# Altium schematic sheet Microcontroller.SchDoc: Microcontroller
size 228 x 165 mm; DrawnBy: Joseph Riesen; DocumentNumber: 2; Revision: 1.0; SheetNumber: 2; SheetTotal: 10
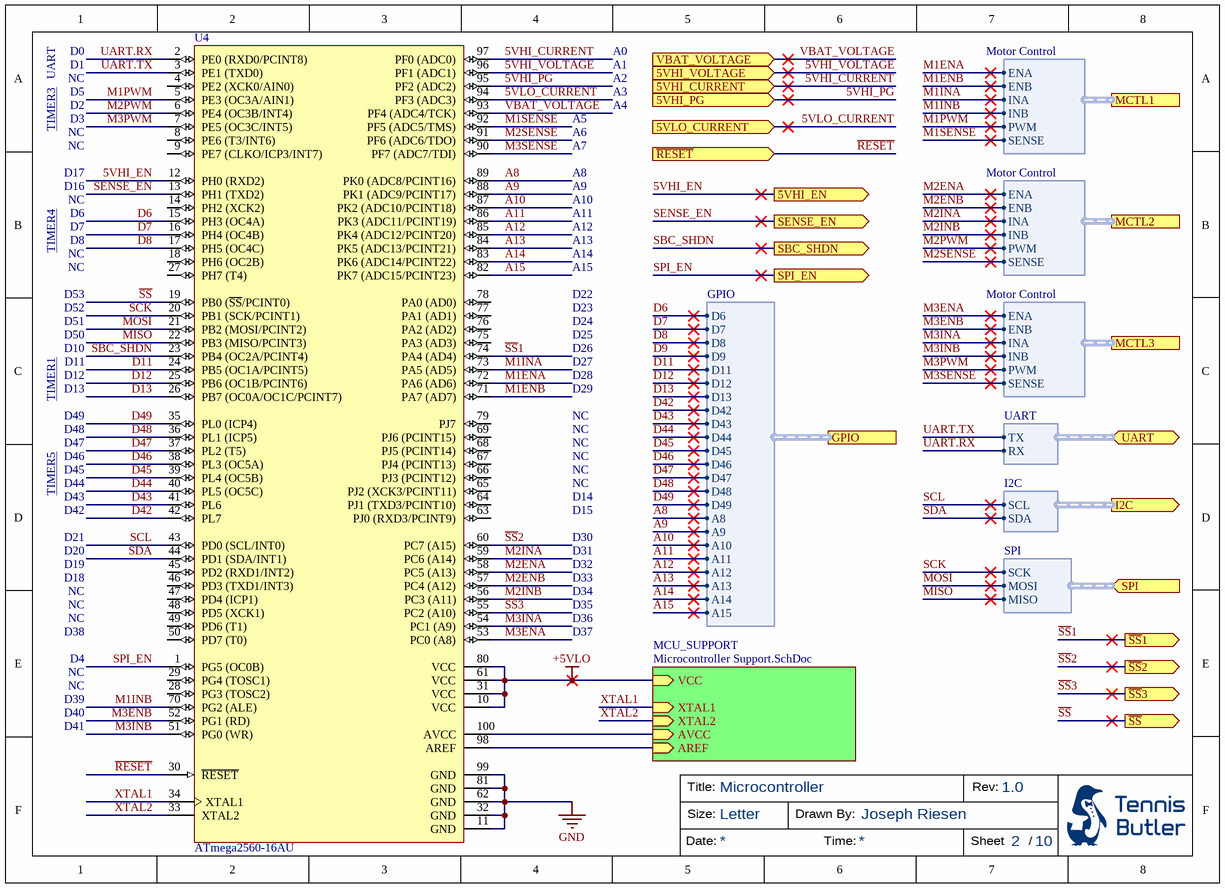
[diagram p0: Microcontroller.SchDoc]

## Parts
U4  ATmega2560-16AU  [TSQFP50P1600X1600X120-100M]

## Sub-sheets
MCU_SUPPORT = Microcontroller Support.SchDoc: XTAL2 (in), XTAL1 (in), AVCC (in), AREF (in), VCC (in)  | ComponentClassName: MCU

## Ports
5VHI_CURRENT (in), 5VHI_EN (out), 5VHI_PG (in), 5VHI_VOLTAGE (in), 5VLO_CURRENT (in), GPIO (harness GPIO), I2C (out, harness I2C), MCTL1 (harness Motor Control), MCTL2 (harness Motor Control), MCTL3 (harness Motor Control), SBC_SHDN (out), SENSE_EN (out), SPI (in, harness SPI), SPI_EN (out), UART (bidir, harness UART), VBAT_VOLTAGE (in), ~{RESET} (in), ~{SS}1 (out), ~{SS}2 (out), ~{SS}3 (out), ~{SS} (out)

## Harnesses
SPI: SCK, MOSI, MISO
UART: TX, RX
Motor Control: ENA, ENB, INA, INB, PWM, SENSE
I2C: SCL, SDA
GPIO: D7, D8, D9, D11, D12, D13, D42, D43, D44, D45, D46, D47, D48, D49, A8, A9, A10, A11, A12, A13, A14, A15, D6

## Nets
+5VLO: U4.10(VCC) U4.31(VCC) U4.61(VCC) U4.80(VCC) ; sheet MCU_SUPPORT/VCC
GND: U4.11(GND) U4.32(GND) U4.62(GND) U4.81(GND) U4.99(GND)
5VHI_CURRENT: U4.97(PF0_(ADC0)) ; port 5VHI_CURRENT
5VHI_EN: U4.12(PH0_(RXD2)) ; port 5VHI_EN
5VHI_PG: U4.95(PF2_(ADC2)) ; port 5VHI_PG
5VHI_VOLTAGE: U4.96(PF1_(ADC1)) ; port 5VHI_VOLTAGE
5VLO_CURRENT: U4.94(PF3_(ADC3)) ; port 5VLO_CURRENT
A8: U4.89(PK0_(ADC8/PCINT16)) ; port GPIO.A8
A9: U4.88(PK1_(ADC9/PCINT17)) ; port GPIO.A9
A10: U4.87(PK2_(ADC10/PCINT18)) ; port GPIO.A10
A11: U4.86(PK3_(ADC11/PCINT19)) ; port GPIO.A11
A12: U4.85(PK4_(ADC12/PCINT20)) ; port GPIO.A12
A13: U4.84(PK5_(ADC13/PCINT21)) ; port GPIO.A13
A14: U4.83(PK6_(ADC14/PCINT22)) ; port GPIO.A14
A15: U4.82(PK7_(ADC15/PCINT23)) ; port GPIO.A15
D6: U4.15(PH3_(OC4A)) ; port GPIO.D6
D7: U4.16(PH4_(OC4B)) ; port GPIO.D7
D8: U4.17(PH5_(OC4C)) ; port GPIO.D8
D9: port GPIO.D9
D11: U4.24(PB5_(OC1A/PCINT5)) ; port GPIO.D11
D12: U4.25(PB6_(OC1B/PCINT6)) ; port GPIO.D12
D13: U4.26(PB7_(OC0A/OC1C/PCINT7)) ; port GPIO.D13
D42: U4.42(PL7) ; port GPIO.D42
D43: U4.41(PL6) ; port GPIO.D43
D44: U4.40(PL5_(OC5C)) ; port GPIO.D44
D45: U4.39(PL4_(OC5B)) ; port GPIO.D45
D46: U4.38(PL3_(OC5A)) ; port GPIO.D46
D47: U4.37(PL2_(T5)) ; port GPIO.D47
D48: U4.36(PL1_(ICP5)) ; port GPIO.D48
D49: U4.35(PL0_(ICP4)) ; port GPIO.D49
M1ENA: U4.72(PA6_(AD6)) ; port MCTL1.ENA
M1ENB: U4.71(PA7_(AD7)) ; port MCTL1.ENB
M1INA: U4.73(PA5_(AD5)) ; port MCTL1.INA
M1INB: U4.70(PG2_(ALE)) ; port MCTL1.INB
M1PWM: U4.5(PE3_(OC3A/AIN1)) ; port MCTL1.PWM
M1SENSE: U4.92(PF5_(ADC5/TMS)) ; port MCTL1.SENSE
M2ENA: U4.58(PC5_(A13)) ; port MCTL2.ENA
M2ENB: U4.57(PC4_(A12)) ; port MCTL2.ENB
M2INA: U4.59(PC6_(A14)) ; port MCTL2.INA
M2INB: U4.56(PC3_(A11)) ; port MCTL2.INB
M2PWM: U4.6(PE4_(OC3B/INT4)) ; port MCTL2.PWM
M2SENSE: U4.91(PF6_(ADC6/TDO)) ; port MCTL2.SENSE
M3ENA: U4.53(PC0_(A8)) ; port MCTL3.ENA
M3ENB: U4.52(PG1_(RD)) ; port MCTL3.ENB
M3INA: U4.54(PC1_(A9)) ; port MCTL3.INA
M3INB: U4.51(PG0_(WR)) ; port MCTL3.INB
M3PWM: U4.7(PE5_(OC3C/INT5)) ; port MCTL3.PWM
M3SENSE: U4.90(PF7_(ADC7/TDI)) ; port MCTL3.SENSE
MISO: U4.22(PB3_(MISO/PCINT3)) ; port SPI.MISO
MOSI: U4.21(PB2_(MOSI/PCINT2)) ; port SPI.MOSI
~{RESET}: U4.30(~{RESET}) ; port ~{RESET}
~{SS}: U4.19(PB0_(~{SS}/PCINT0)) ; port ~{SS}
~{SS}1: U4.74(PA4_(AD4)) ; port ~{SS}1
~{SS}2: U4.60(PC7_(A15)) ; port ~{SS}2
~{SS}3: U4.55(PC2_(A10)) ; port ~{SS}3
SBC_SHDN: U4.23(PB4_(OC2A/PCINT4)) ; port SBC_SHDN
SCK: U4.20(PB1_(SCK/PCINT1)) ; port SPI.SCK
SCL: U4.43(PD0_(SCL/INT0)) ; port I2C.SCL
SDA: U4.44(PD1_(SDA/INT1)) ; port I2C.SDA
SENSE_EN: U4.13(PH1_(TXD2)) ; port SENSE_EN
SPI_EN: U4.1(PG5_(OC0B)) ; port SPI_EN
UART.RX: U4.2(PE0_(RXD0/PCINT8)) ; port UART.RX
UART.TX: U4.3(PE1_(TXD0)) ; port UART.TX
VBAT_VOLTAGE: U4.93(PF4_(ADC4/TCK)) ; port VBAT_VOLTAGE
XTAL1: U4.34(XTAL1) ; sheet MCU_SUPPORT/XTAL1
XTAL2: U4.33(XTAL2) ; sheet MCU_SUPPORT/XTAL2
NetU4_98: U4.98(AREF) ; sheet MCU_SUPPORT/AREF
NetU4_100: U4.100(AVCC) ; sheet MCU_SUPPORT/AVCC

Not connected (* = marked no-connect by the designer): U4 4(PE2_(XCK0/AIN0)) 8(PE6_(T3/INT6)) 9(PE7_(CLKO/ICP3/INT7)) 14(PH2_(XCK2)) 18(PH6_(OC2B)) 27(PH7_(T4)) 28(PG3_(TOSC2)) 29(PG4_(TOSC1)) 45(PD2_(RXD1/INT2)) 46(PD3_(TXD1/INT3)) 47(PD4_(ICP1)) 48(PD5_(XCK1)) 49(PD6_(T1)) 50(PD7_(T0)) 63(PJ0_(RXD3/PCINT9)) 64(PJ1_(TXD3/PCINT10)) 65(PJ2_(XCK3/PCINT11)) 66(PJ3_(PCINT12)) 67(PJ4_(PCINT13)) 68(PJ5_(PCINT14)) 69(PJ6_(PCINT15)) 75(PA3_(AD3)) 76(PA2_(AD2)) 77(PA1_(AD1)) 78(PA0_(AD0)) 79(PJ7)

## Notes on the sheet
- TIMER3
- UART
- D5
- NC
- D0
- D1
- A0
- A1
- A2
- A3
- D2
- D3
- A5
- A6
- A7
- A4
- TIMER4
- D6
- D7
- D17
- D16
- A8
- A9
- A10
- A11
- A12
- D8
- D53
- A13
- A14
- A15
- D22
- TIMER1
- D11
- D52
- D51
- D50
- D10
- D25
- D26
- D27
- D24
- D23
- D12
- D13
- D48
- D49
- D28
- D29
- TIMER5
- D44
- D45
- D46
- D47
- D43
- D14
- D21
- D20
- D19
- D42
- D30
- D31
- D32
- D15
- D38
- D18
- D33
- D34
- D35
- D36
- D37
- D39
- D4
- D40
- D41
- Title:
- Size:
- Letter
- Drawn By:
- Rev:
- Date:
- Time:
- Sheet
- /

## Library data of the parts
U4 = ATmega2560-16AU: 8-bit AVR Microcontroller, 4.5-5.5V, 16MHz, 256KB Flash, 4KB EEPROM, 8KB SRAM, 86 GPIO pins, 100-pin TQFP, Industrial Grade (-40°C to 85°C), Pb-Free; Manufacturer: Microchip / Atmel; Interface: 2-Wire,EBI/EMI,I2C,SPI,UART,USART; Data Bus Width: 8b; Number of I/Os: 86; Oscillator Type: Internal; Peripherals: Brown-out Detect/Reset,POR,PWM,WDT; Number of Timers/Counters: 6; Min Supply Voltage: 4.5V; Max Supply Voltage: 5.5V; Watchdog Timer: Yes; Operating Supply Voltage: 5V; Access Time: 16us; Number of PWM Channels: 12; Number of ADC Channels: 16; Number of SPI Channels: 1; Supplier 1: Digi-Key; Manufacturer Part Number: ATMEGA2560-16AU; Stock 1: 11396; Pricing 1: 1 = 12.21000, 25 = 11.18600, 100 = 10.13520 (USD); RoHS: Yes; Mount: Surface Mount; Case/Package: A; Number of Pins: 100; Number of Terminals: 100; Min Operating Temperature: -40°C; Max Operating Temperature: 85°C; Core Architecture: AVR; Package Quantity: 90; Packaging: Tray; Memory Size: 256KB; Frequency: 16MHz; Memory Type: FLASH; RAM Size: 8KB; Max Frequency: 16MHz; Number of Programmable I/O: 86; Density: 256KB; Number of I2C Channels: 1; Termination: SMD/SMT; Length: 14.1mm; Height: 1.05mm; Width: 14.1mm; Radiation Hardening: No; Lead Free: Lead Free; REACH SVHC: No SVHC; ComponentLink1URL: http://www.farnell.com/datasheets/2013645.pdf?src-supplier=Element14; ComponentLink1Description: http://www.farnell.com/datasheets/2013645.pdf?src-supplier=Element14; ComponentLink2URL: http://www.farnell.com/datasheets/1817551.pdf?src-supplier=Verical; ComponentLink2Description: http://www.farnell.com/datasheets/1817551.pdf?src-supplier=Verical; ComponentLink3URL: http://www.microchip.com/mymicrochip/filehandler.aspx?ddocname=en589901&src-supplier=Digi-Key; ComponentLink3Description: http://www.microchip.com/mymicrochip/filehandler.aspx?ddocname=en589901&src-supplier=Digi-Key; ComponentLink4URL: http://www.farnell.com/datasheets/33246.pdf?src-supplier=Farnell; ComponentLink4Description: http://www.farnell.com/datasheets/33246.pdf?src-supplier=Farnell; ComponentLink5URL: http://www.alliedelec.com/images/products/datasheets/bm/ATMEL/70123980.pdf?src-supplier=Allied+Electronics; ComponentLink5Description: http://www.alliedelec.com/images/products/datasheets/bm/ATMEL/70123980.pdf?src-supplier=Allied+Electronics; ComponentLink6URL: http://www.farnell.com/datasheets/1698622.pdf?src-supplier=Farnell; ComponentLink6Description: http://www.farnell.com/datasheets/1698622.pdf?src-supplier=Farnell; ComponentLink7URL: http://datasheet.iiic.cc/atmel/ATMEGA2560-16AU.pdf?src-supplier=IIIC; ComponentLink7Description: http://datasheet.iiic.cc/atmel/ATMEGA2560-16AU.pdf?src-supplier=IIIC; ComponentLink8URL: http://www.produktinfo.conrad.com/datenblaetter/150000-174999/154804-da-01-en-ATMEGA2560_16AU_TQFP_100.pdf?src-supplier=Conrad; ComponentLink8Description: http://www.produktinfo.conrad.com/datenblaetter/150000-174999/154804-da-01-en-ATMEGA2560_16AU_TQFP_100.pdf?src-supplier=Conrad; Supplier Part Number 1: ATMEGA2560-16AU-ND; Pin Count: 100